# Altium schematic sheet HV Sense.SchDoc
size A4
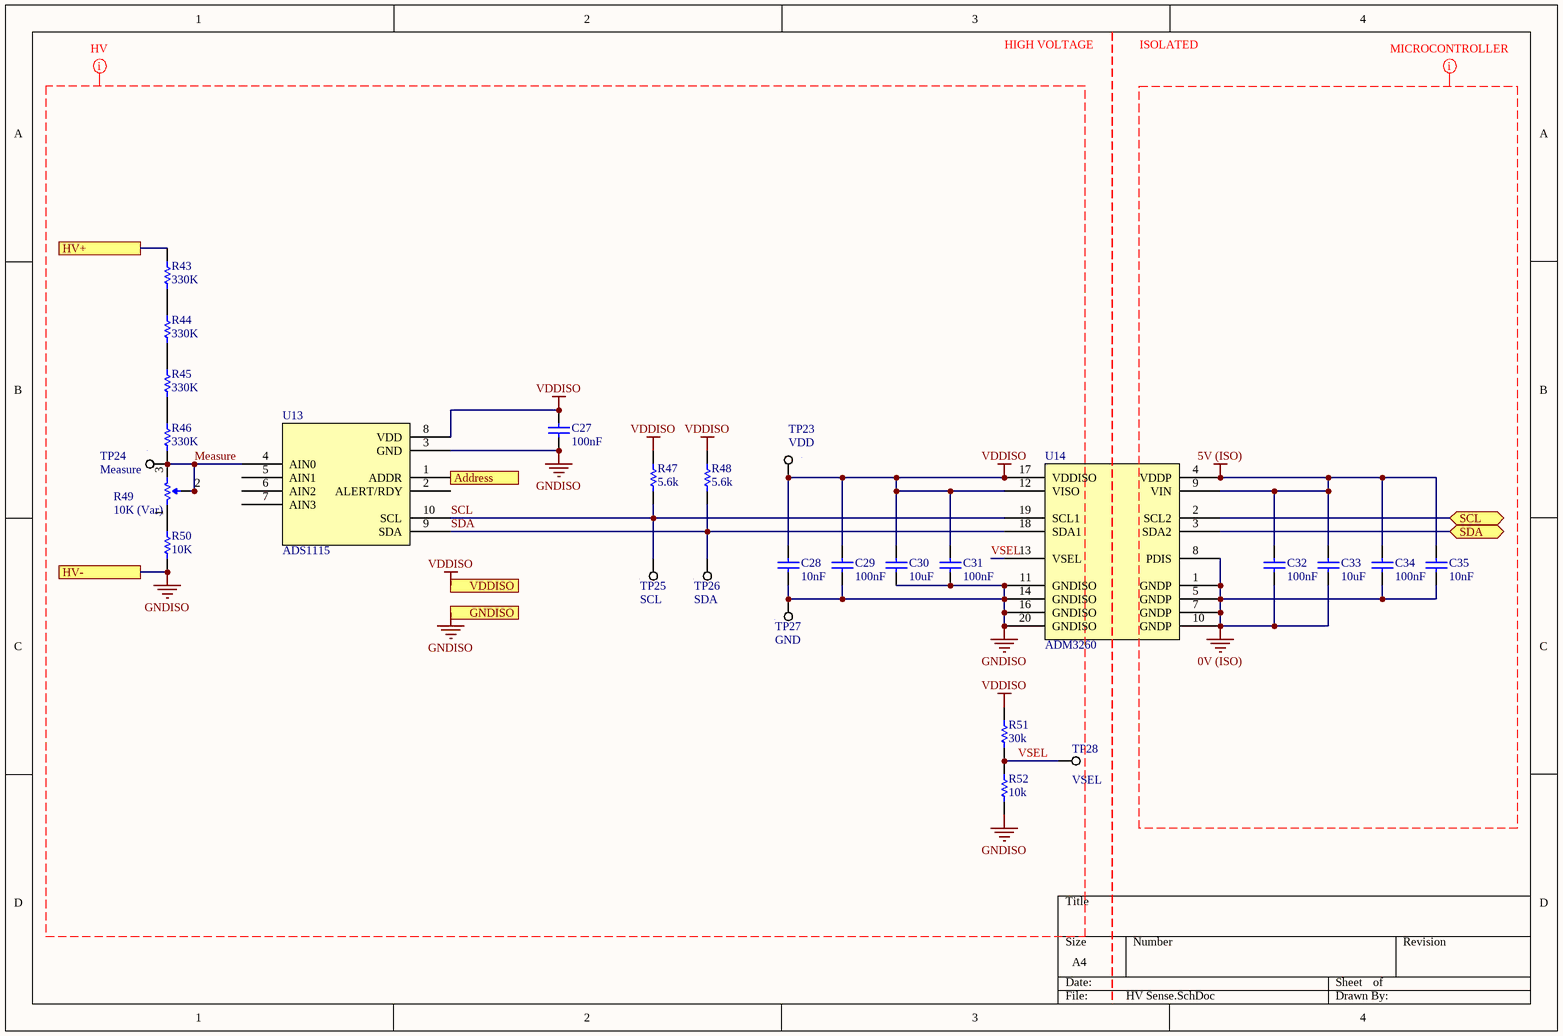
[diagram p0: HV Sense.SchDoc]

## Parts
C27  100nF  [0805]
C28  10nF  [0805]
C29  100nF  [0805]
C30  10uF  [0805]
C31  100nF  [0805]
C32  100nF  [0805]
C33  10uF  [0805]
C34  100nF  [0805]
C35  10nF  [0805]
R43  330K  [VB 0204]
R44  330K  [VB 0204]
R45  330K  [VB 0204]
R46  330K  [VB 0204]
R47  5.6k  [0805]
R48  5.6k  [0805]
R49  10K (Var)  [B 3296]
R50  10K  [VB 0204]
R51  30k  [0805]
R52  10k  [0805]
TP23  VDD  [SMD Test Point 1mm]
TP24  Measure  [SMD Test Point 1mm]
TP25  SCL  [SMD Test Point 1mm]
TP26  SDA  [SMD Test Point 1mm]
TP27  GND  [SMD Test Point 1mm]
TP28  VSEL  [SMD Test Point 1mm]
U13  ADS1115  [TI 10-VSSOP]
U14  ADM3260  [AD 20-SSOP]

## Ports
Address, GNDISO, HV+, HV-, SCL (bidir), SDA (bidir), VDDISO

## Nets
0V (ISO): C32.1 C33.1 C34.1 C35.1 U14.1(GNDP) U14.5(GNDP) U14.7(GNDP) U14.8(PDIS) U14.10(GNDP)
5V (ISO): C32.2 C33.2 C34.2 C35.2 U14.4(VDDP) U14.9(VIN)
GNDISO: C27.2 C28.1 C29.1 C30.1 C31.2 R50.1 R52.1 TP27.1 U13.3(GND) U14.11(GNDISO) U14.14(GNDISO) U14.16(GNDISO) U14.20(GNDISO) ; port HV-, port GNDISO
VDDISO: C27.1 C28.2 C29.2 C30.2 C31.1 R47.2 R48.2 R51.2 TP23.1 U13.8(VDD) U14.12(VISO) U14.17(VDDISO) ; port VDDISO
Address: U13.1(ADDR) ; port Address
HV+: R43.2 ; port HV+
Measure: R46.1 R49.2(Wiper) R49.3(CW) TP24.1 U13.4(AIN0)
SCL: R47.1 TP25.1 U13.10(SCL) U14.19(SCL1)
SCL: U14.2(SCL2) ; port SCL  [a separate net that carries the same name]
SDA: R48.1 TP26.1 U13.9(SDA) U14.18(SDA1)
SDA: U14.3(SDA2) ; port SDA  [a separate net that carries the same name]
VSEL: R51.1 R52.2 TP28.1 U14.13(VSEL)
NetR43_1: R43.1 R44.2
NetR44_1: R44.1 R45.2
NetR45_1: R45.1 R46.2
NetR49_1: R49.1(CCW) R50.2

Not connected (* = marked no-connect by the designer): U13 2(ALERT/RDY) 5(AIN1) 6(AIN2) 7(AIN3)

## Layout directives
net class MICROCONTROLLER: 0V (ISO), 5V (ISO)
net class HV: GNDISO, Measure, SCL, SDA, VDDISO, VSEL

## Notes on the sheet
- HIGH VOLTAGE
- ISOLATED

## Library data of the parts
C27 C29 C31 C32 C34 = GCM21BR71H104KA37L: Manufacturer: muRata; Tolerance: ±10%; Material: X7R; Rated Voltage: 50V; Part Number: GCM21BR71H104KA37L; Value: 100nF; Digikey Part Number: 490-6064-1-ND
C28 C35 = GCM2195C1H103JA16D: Manufacturer: muRata; Tolerance: ±5%; Material: C0G, NP0; Rated Voltage: 50V; Part Number: GCM2195C1H103JA16D; Value: 10nF; Digikey Part Number: 490-4783-1-ND
C30 C33 = GRM21BR6YA106KE43L: Manufacturer: muRata; Tolerance: 10%; Material: X5R; Rated Voltage: 50V; Part Number: GRM21BR6YA106KE43L; Value: 10uF; Digikey Part Number: 490-10514-6-ND
R43-R46 = MMA02040C3303FB300: Manufacturer: Vishay Beyschlag; Tolerance: 0.01; Rated Voltage: 0.4W; Part Number: MMA02040C3303FB300; Value: 330K; Digikey Part Number: MMA-330KACT-ND
R47 R48 = RC0805FR075K6L: Manufacturer: YAGEO; Tolerance: 0.01; Rated Voltage: 0.125W; Part Number: RC0805FR075K6L; Value: 5.6k; Material: FR-07; Digikey Part Number: 311-5.60KCRCT-ND
R49 = 3296W-1-103LF: Manufacturer: Bournes Inc; Tolerance: 0.1; Rated Voltage: 0.5W; Part Number: 3296W-1-103LF; Value: 10K (Var); Digikey Part Number: 3296W-103LF-ND
R50 = MMA02040C1002FB300: Manufacturer: Vishay Beyschlag; Tolerance: 0.01; Rated Voltage: 0.4W; Part Number: MMA02040C1002FB300; Value: 10K; Digikey Part Number: MMA-10KACT-ND
R51 = RC0805FR0730KL: Manufacturer: YAGEO; Tolerance: 0.01; Rated Voltage: 0.125W; Part Number: RC0805FR0730KL; Value: 30k; Material: FR-07; Digikey Part Number: 311-30.0KCRCT-ND
R52 = RC0805FR0710KL: Manufacturer: YAGEO; Tolerance: 0.01; Rated Voltage: 0.125W; Part Number: RC0805FR0710KL; Value: 10k; Material: FR-07; Digikey Part Number: 311-10.0KCRCT-ND
TP23-TP28 = SMD Test Point Small: Positions: 1; Pitch: 0mm; Row Spacing: 0; Flange: No; Contact: NA; Part Number: SMD Test Point Small; Angle: 0
U13 = ADS1115: 16 Bit Analog to Digital Converter 2, 4 Input 1 Sigma-Delta 10-VSSOP; Manufacturer: Texas Instruments; Part Number: ADS1115; Digikey Part Number: 296-38849-1-ND; Digikey Link: https://www.digikey.com/product-detail/en/texas-instruments/ADS1115IDGSR/296-38849-1-ND/5142969
U14 = ADM3260: I²C Digital Isolator 2500Vrms 2 Channel 25kV/µs CMTI 20-SSOP (0.209", 5.30mm Width); Manufacturer: Analog Devices; Part Number: ADM3260; Digikey Part Number: ADM3260ARSZ-RL7CT-ND; Digikey Link: https://www.digikey.com/product-detail/en/analog-devices-inc/ADM3260ARSZ-RL7/ADM3260ARSZ-RL7CT-ND/5233040